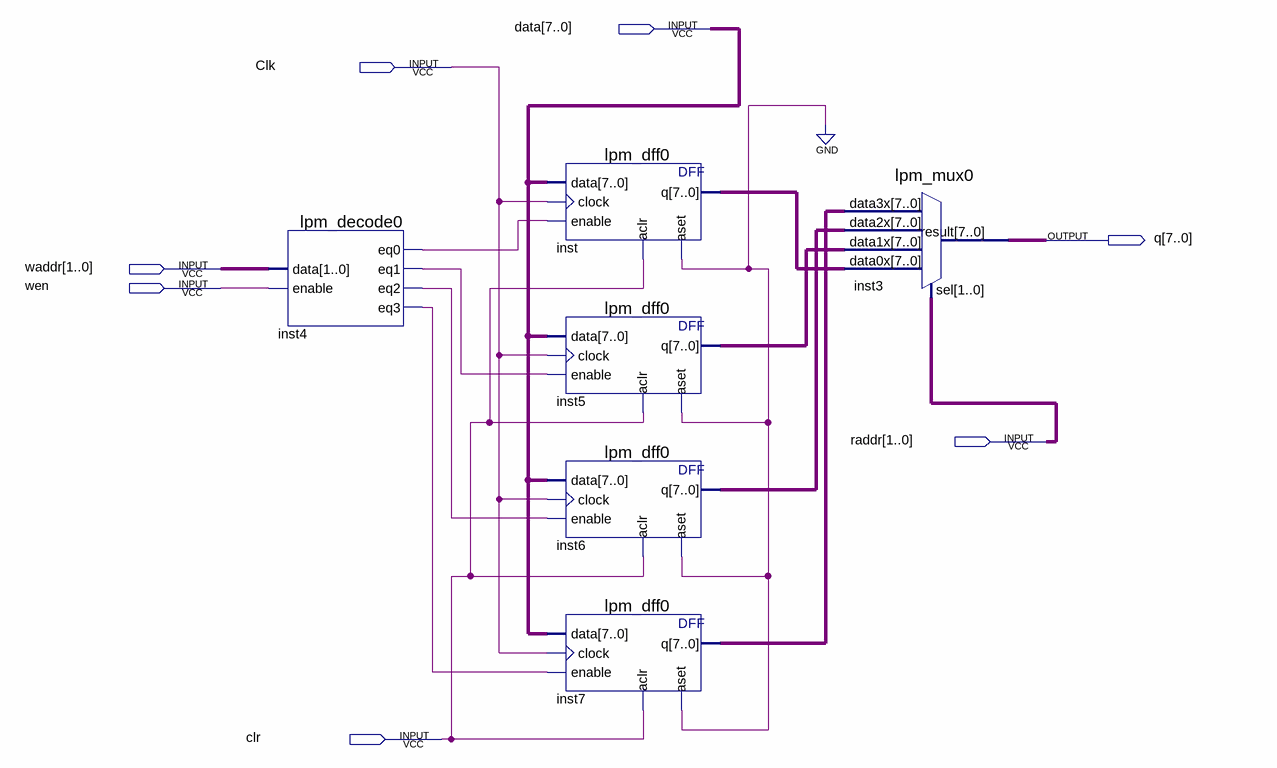
[diagram p0: schematic sheet]
// Quartus schematic Pro1_final.bdf as structural Verilog: 6 symbols, 7 pins
module Pro1_final (
  input  [7:0] data,
  input  Clk,
  input  [1:0] waddr,
  input  wen,
  input  [1:0] raddr,
  input  clr,
  output [7:0] q
);

  wire inst4_eq0, inst4_eq1, inst4_eq2, inst4_eq3;
  wire [7:0] inst5_q, inst6_q, inst7_q, inst_q;

  lpm_decode0 inst4 (.data(waddr), .enable(wen), .eq0(inst4_eq0), .eq1(inst4_eq1), .eq2(inst4_eq2), .eq3(inst4_eq3));
  lpm_dff0 inst (.data(data), .clock(Clk), .enable(inst4_eq0), .aclr(clr), .aset(1'b0), .q(inst_q));
  lpm_dff0 inst5 (.data(data), .clock(Clk), .enable(inst4_eq1), .aclr(clr), .aset(1'b0), .q(inst5_q));
  lpm_dff0 inst6 (.data(data), .clock(Clk), .enable(inst4_eq2), .aclr(clr), .aset(1'b0), .q(inst6_q));
  lpm_dff0 inst7 (.data(data), .clock(Clk), .enable(inst4_eq3), .aclr(clr), .aset(1'b0), .q(inst7_q));
  lpm_mux0 inst3 (.data3x(inst7_q), .data2x(inst6_q), .data1x(inst5_q), .data0x(inst_q), .sel(raddr), .result(q));
endmodule
